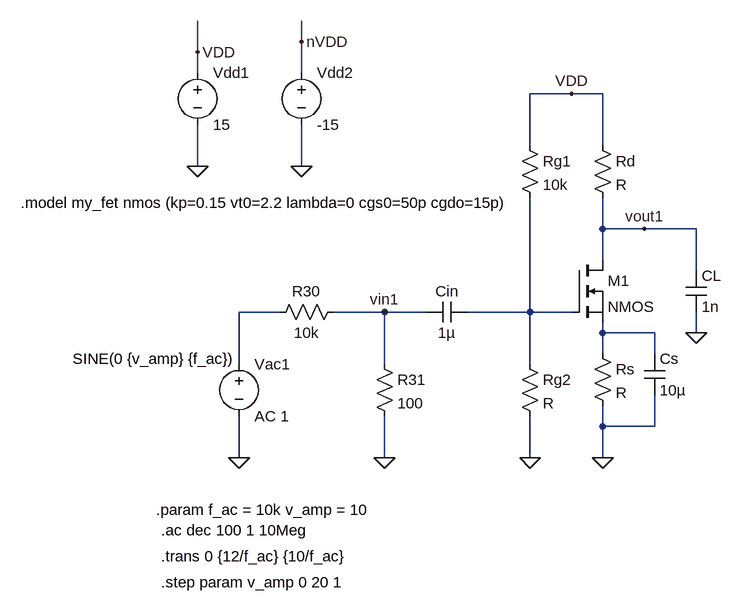
[diagram p0: schematic Single-Stage-Amplifier.asc]
Single-Stage-Amplifier.asc, the LTspice schematic file:
Version 4
SHEET 1 880 768
WIRE 32 -80 32 -112
WIRE -128 -64 -128 -112
WIRE -128 -32 -128 -64
WIRE 32 -32 32 -80
WIRE 448 0 384 0
WIRE 496 0 448 0
WIRE 384 80 384 0
WIRE 496 80 496 0
WIRE -128 112 -128 48
WIRE 32 112 32 48
WIRE 496 208 496 160
WIRE 560 208 496 208
WIRE 640 208 560 208
WIRE 496 256 496 208
WIRE 640 272 640 208
WIRE 0 336 -64 336
WIRE 160 336 80 336
WIRE 224 336 160 336
WIRE 384 336 384 160
WIRE 384 336 288 336
WIRE 448 336 384 336
WIRE 496 368 496 352
WIRE 576 368 496 368
WIRE 640 368 640 336
WIRE 496 400 496 368
WIRE 576 400 576 368
WIRE -64 416 -64 336
WIRE 160 416 160 336
WIRE 384 416 384 336
WIRE 496 512 496 480
WIRE 576 512 576 464
WIRE 576 512 496 512
WIRE -64 560 -64 496
WIRE 160 560 160 496
WIRE 384 560 384 496
WIRE 496 560 496 512
FLAG 384 560 0
FLAG 496 560 0
FLAG 160 560 0
FLAG -64 560 0
FLAG 448 0 VDD
FLAG 560 208 vout1
FLAG 640 368 0
FLAG 160 336 vin1
FLAG -128 112 0
FLAG 32 112 0
FLAG -128 -64 VDD
FLAG 32 -80 nVDD
SYMBOL nmos 448 256 R0
SYMATTR InstName M1
SYMBOL Res 480 64 R0
SYMATTR InstName Rd
SYMBOL Res 368 64 R0
SYMATTR InstName Rg1
SYMATTR Value 10k
SYMBOL Res 368 400 R0
SYMATTR InstName Rg2
SYMBOL Res 480 384 R0
SYMATTR InstName Rs
SYMBOL Cap 560 400 R0
SYMATTR InstName Cs
SYMATTR Value 10µ
SYMBOL Cap 288 320 R90
WINDOW 0 0 32 VBottom 2
WINDOW 3 32 32 VTop 2
SYMATTR InstName Cin
SYMATTR Value 1µ
SYMBOL Res 144 400 R0
SYMATTR InstName R31
SYMATTR Value 100
SYMBOL Res 96 320 R90
WINDOW 0 0 56 VBottom 2
WINDOW 3 32 56 VTop 2
SYMATTR InstName R30
SYMATTR Value 10k
SYMBOL Voltage -64 400 R0
SYMATTR InstName Vac1
SYMATTR Value AC 1
SYMBOL Cap 624 272 R0
SYMATTR InstName CL
SYMATTR Value 1n
SYMBOL Voltage -128 -48 R0
SYMATTR InstName Vdd1
SYMATTR Value 15
SYMBOL Voltage 32 -48 R0
SYMATTR InstName Vdd2
SYMATTR Value -15
TEXT -320 408 Left 2 !SINE(0 {v_amp} {f_ac})
TEXT -400 168 Left 2 !.model my_fet nmos (kp=0.15 vt0=2.2 lambda=0 cgs0=50p cgdo=15p)
TEXT -192 640 Left 2 !.param f_ac = 10k v_amp = 10
TEXT -184 672 Left 2 !.ac dec 100 1 10Meg
TEXT -184 712 Left 2 !.trans 0 {12/f_ac} {10/f_ac}
TEXT -184 752 Left 2 !.step param v_amp 0 20 1

The netlist it stands for:
* Single-Stage-Amplifier.asc
M1 vout1 N002 N003 N003 NMOS
Rd VDD vout1 R
Rg1 VDD N002 10k
Rg2 N002 0 R
Rs N003 0 R
Cs N003 0 10µ
Cin N002 vin1 1µ
R31 vin1 0 100
R30 vin1 N001 10k
Vac1 N001 0 AC 1
CL vout1 0 1n
Vdd1 VDD 0 15
Vdd2 nVDD 0 -15
.model NMOS NMOS
.model PMOS PMOS
.lib standard.mos
SINE(0 {v_amp} {f_ac})
.model my_fet nmos (kp=0.15 vt0=2.2 lambda=0 cgs0=50p cgdo=15p)
.param f_ac = 10k v_amp = 10
.ac dec 100 1 10Meg
.trans 0 {12/f_ac} {10/f_ac}
.step param v_amp 0 20 1
.backanno
.end